# Altium schematic sheet gydrodrive_sensor.SchDoc
size 297 x 209 mm; SheetNumber: 19; SheetTotal: 22
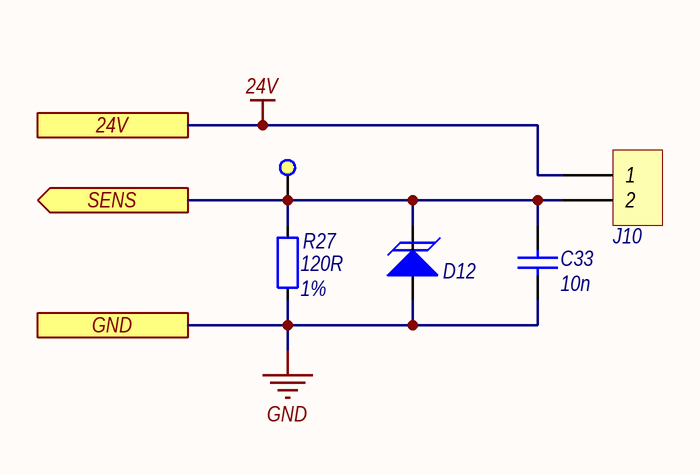
[diagram p0: gydrodrive_sensor.SchDoc]

## Parts
C33  Capacitance: 10n  [CAPC2012-0805M]  (hidden comment: CAP_0805)
D12  SMBJ3V3-E3/52  [SMB_M]  (value not drawn)
J10  DG142V-5.08-02P  [DG142V-5.08-02P]  (value not drawn)
R27  Resistance: 120R  Tolerance: 1%  [RESC2012-0805M]  (hidden comment: RES_0805)
TP9  Test point 1  [TP_1]  (value not drawn)  (no BOM)

## Ports
24V (see gydrodrive_sensors[3B], gydrodrive_button[2B], gydrodrive_control[2B], gydrodrive_currentSource[2B], gydrodrive_discreteControl[4B], gydrodrive_encoder[3B], gydrodrive_linearPosSensor[3B], gydrodrive_sensors[2B], gydrodrive_sto[3B], gydrodrive_supply[2C]), GND (see gydrodrive_sensors[3C], gydrodrive_button[2C], gydrodrive_can[3C], gydrodrive_control[2C], gydrodrive_currentSource[2B], gydrodrive_debugger[3C], gydrodrive_discreteControl[3B], gydrodrive_encoder[1B], gydrodrive_i2c[5C], gydrodrive_indication[3C], gydrodrive_inputTrim[2C], gydrodrive_interfaces[3A], gydrodrive_linearPosSensor[2C], gydrodrive_mcu[6D], gydrodrive_reservedPins[2C], gydrodrive_rs485[3B], gydrodrive_sensors[2B], gydrodrive_sto[2C], gydrodrive_supply[2C], gydrodrive_uart[4C]), SENS (out, see gydrodrive_sensors[3C])

## Nets
24V: J10.1 ; port 24V
GND: C33.1 D12.2(A) R27.1 ; port GND
SENS: C33.2 D12.1(K) J10.2 R27.2 TP9.1 ; port SENS

## Notes on the sheet
- Подп. и дата
- Инв. № дубл.
- Взам. инв. №
- Инв. № подл.
- Изм.
- Лист
- № докум.
- Подп.
- Дата
- Копировал
- Формат
- A4

## Library data of the parts
C33 = CAPC_0805: Конденсатор керамический, корпус 0805; Parameters: 10n,  50V; Voltage: 50V; Max Price: 5; Part Number: CAPC_0805; Part Name: ='Конд-р керам. 0805,  '  + Parameters; Component Type: Standart; Pin Count: 2
D12 = SMBJ3V3-E3/52: Защитный диод (TVS); Part Name: Защитный диод SMBJ3V3-E3/52; Parameters: 3V3, 600W; Voltage: 3V3; Max Price: 40; Part Number: SMBJ3V3-E3/52; Component Type: Standart; Pin Count: 0
J10 = DG142V-5.08-02P: Клеммник 2-контактный, шаг 5.08 мм; Part Name: Клеммник DG142V-5.08-02P; Parameters: 8А; Max Price: 60; System: Connector; Part Number: DG142V-5.08-02P; Component Type: Standart; Pin Count: 2
R27 = RESC_0805: Рез-р, корпус 0805; Parameters: 120R, 1%; Max Price: 3; Part Number: RESC_0805; Part Name: ='Рез-р 0805, ' + Parameters; Component Type: Standart
TP9 = Test point 1: Тестовый контакт круглый 1 мм; Part Number: Test point 1; Part Name: Тестовый контакт; Component Type: Standart (No BOM)